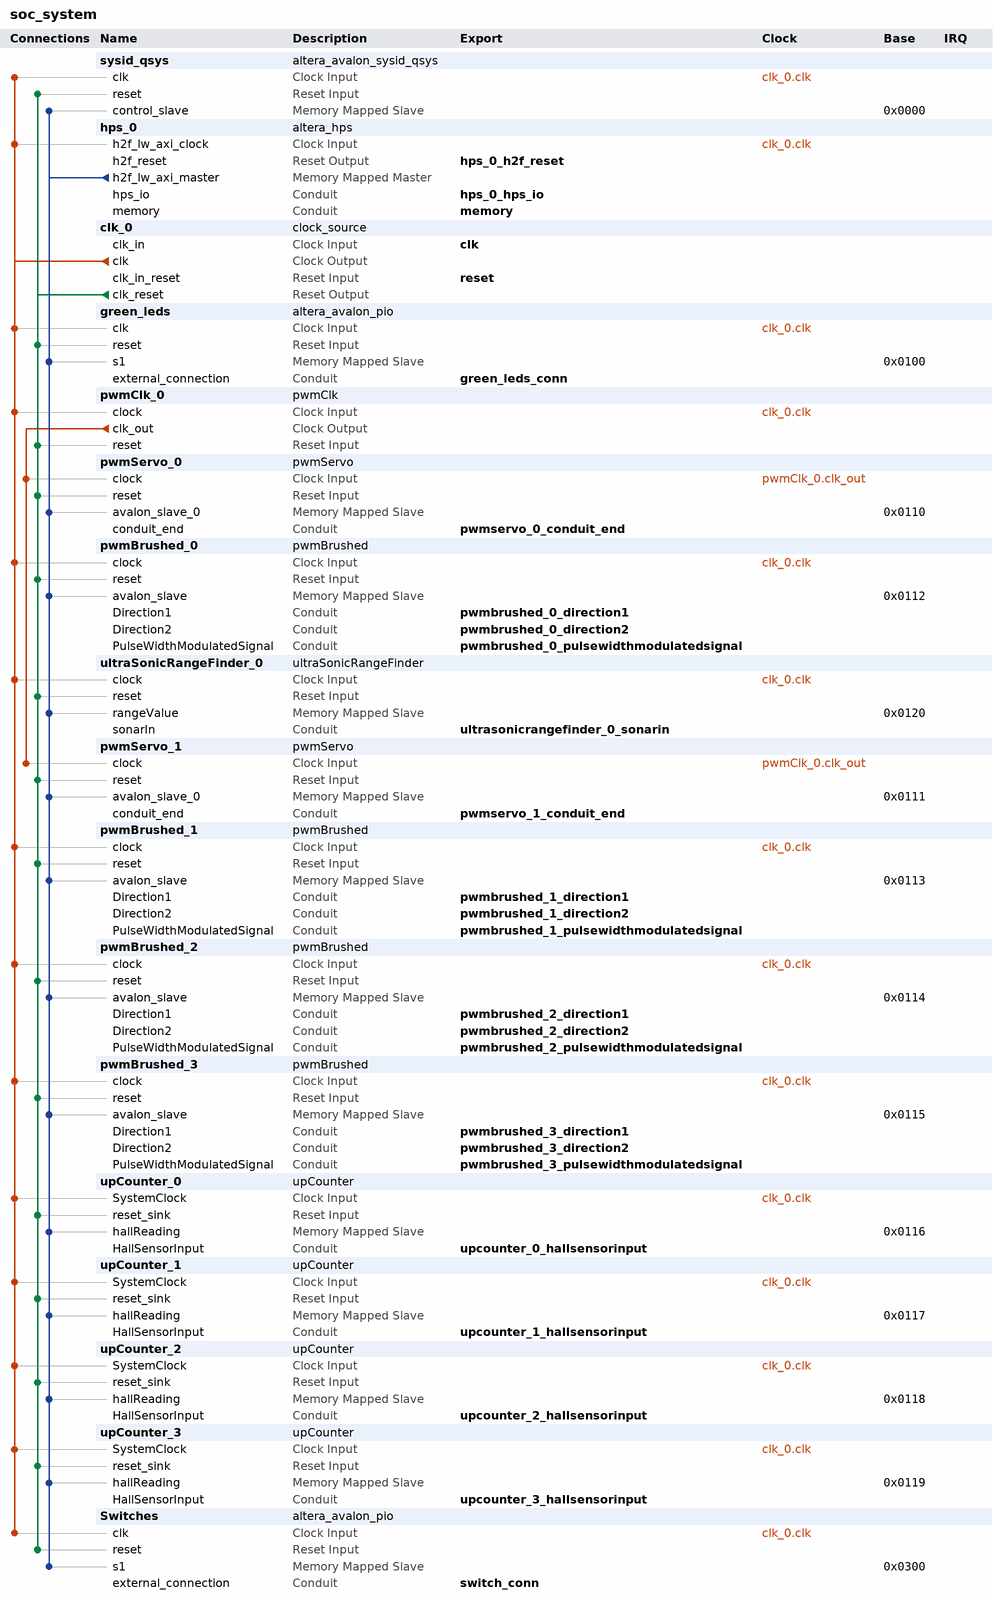
[diagram p0: system contents]
# Platform Designer (Qsys) system soc_system, Cyclone V 5CSEBA6U23I7
# Parameters at their usual value, and those the tool derives, are not listed.
package require -exact qsys 17.0
create_system soc_system
set_project_property DEVICE_FAMILY {Cyclone V}
set_project_property DEVICE 5CSEBA6U23I7

add_instance sysid_qsys altera_avalon_sysid_qsys 17.0
set_instance_parameter_value sysid_qsys id -1395322110

add_instance hps_0 altera_hps 17.0
set_instance_parameter_value hps_0 EMAC1_Mode RGMII
set_instance_parameter_value hps_0 EMAC1_PinMuxing {HPS I/O Set 0}
set_instance_parameter_value hps_0 F2SCLK_COLDRST_Enable false
set_instance_parameter_value hps_0 F2SCLK_DBGRST_Enable false
set_instance_parameter_value hps_0 F2SCLK_WARMRST_Enable false
set_instance_parameter_value hps_0 F2SINTERRUPT_Enable true
set_instance_parameter_value hps_0 F2S_Width 0
set_instance_parameter_value hps_0 FPGA_PERIPHERAL_OUTPUT_CLOCK_FREQ_EMAC0_GTX_CLK 100
set_instance_parameter_value hps_0 FPGA_PERIPHERAL_OUTPUT_CLOCK_FREQ_EMAC0_MD_CLK 100.0
set_instance_parameter_value hps_0 FPGA_PERIPHERAL_OUTPUT_CLOCK_FREQ_EMAC1_GTX_CLK 100
set_instance_parameter_value hps_0 FPGA_PERIPHERAL_OUTPUT_CLOCK_FREQ_EMAC1_MD_CLK 100.0
set_instance_parameter_value hps_0 HPS_PROTOCOL DDR3
set_instance_parameter_value hps_0 I2C0_Mode I2C
set_instance_parameter_value hps_0 I2C0_PinMuxing {HPS I/O Set 0}
set_instance_parameter_value hps_0 I2C1_Mode I2C
set_instance_parameter_value hps_0 I2C1_PinMuxing {HPS I/O Set 0}
set_instance_parameter_value hps_0 LWH2F_Enable true
set_instance_parameter_value hps_0 MEM_BANKADDR_WIDTH 3
set_instance_parameter_value hps_0 MEM_CLK_FREQ 400.0
set_instance_parameter_value hps_0 MEM_COL_ADDR_WIDTH 10
set_instance_parameter_value hps_0 MEM_DQ_WIDTH 32
set_instance_parameter_value hps_0 MEM_DRV_STR RZQ/7
set_instance_parameter_value hps_0 MEM_ROW_ADDR_WIDTH 15
set_instance_parameter_value hps_0 MEM_RTT_NOM RZQ/4
set_instance_parameter_value hps_0 MEM_RTT_WR {Dynamic ODT off}
set_instance_parameter_value hps_0 MEM_TCL 7
set_instance_parameter_value hps_0 MEM_TFAW_NS 30.0
set_instance_parameter_value hps_0 MEM_TRAS_NS 35.0
set_instance_parameter_value hps_0 MEM_TRCD_NS 13.75
set_instance_parameter_value hps_0 MEM_TRFC_NS 260.0
set_instance_parameter_value hps_0 MEM_TRP_NS 13.75
set_instance_parameter_value hps_0 MEM_VENDOR Other
set_instance_parameter_value hps_0 MEM_WTCL 7
set_instance_parameter_value hps_0 QSPI_Mode N/A
set_instance_parameter_value hps_0 QSPI_PinMuxing Unused
set_instance_parameter_value hps_0 REF_CLK_FREQ 25.0
set_instance_parameter_value hps_0 S2FCLK_USER2CLK 4
set_instance_parameter_value hps_0 S2F_Width 0
set_instance_parameter_value hps_0 SDIO_Mode {4-bit Data}
set_instance_parameter_value hps_0 SDIO_PinMuxing {HPS I/O Set 0}
set_instance_parameter_value hps_0 SPIM1_Mode {Single Slave Select}
set_instance_parameter_value hps_0 SPIM1_PinMuxing {HPS I/O Set 0}
set_instance_parameter_value hps_0 STM_Enable false
set_instance_parameter_value hps_0 TIMING_BOARD_AC_SKEW 0.02
set_instance_parameter_value hps_0 TIMING_BOARD_AC_TO_CK_SKEW 0.01
set_instance_parameter_value hps_0 TIMING_BOARD_DQ_TO_DQS_SKEW 0.05
set_instance_parameter_value hps_0 TIMING_BOARD_MAX_CK_DELAY 0.03
set_instance_parameter_value hps_0 TIMING_BOARD_MAX_DQS_DELAY 0.02
set_instance_parameter_value hps_0 TIMING_BOARD_SKEW_BETWEEN_DQS 0.06
set_instance_parameter_value hps_0 TIMING_BOARD_SKEW_CKDQS_DIMM_MAX 0.12
set_instance_parameter_value hps_0 TIMING_BOARD_SKEW_CKDQS_DIMM_MIN 0.06
set_instance_parameter_value hps_0 TIMING_BOARD_SKEW_WITHIN_DQS 0.01
set_instance_parameter_value hps_0 TIMING_TDH 65
set_instance_parameter_value hps_0 TIMING_TDQSCK 255
set_instance_parameter_value hps_0 TIMING_TDQSQ 125
set_instance_parameter_value hps_0 TIMING_TDS 30
set_instance_parameter_value hps_0 TIMING_TIH 140
set_instance_parameter_value hps_0 TIMING_TIS 180
set_instance_parameter_value hps_0 TIMING_TQSH 0.4
set_instance_parameter_value hps_0 UART0_Mode {No Flow Control}
set_instance_parameter_value hps_0 UART0_PinMuxing {HPS I/O Set 0}
set_instance_parameter_value hps_0 USB1_Mode SDR
set_instance_parameter_value hps_0 USB1_PinMuxing {HPS I/O Set 0}
set_instance_parameter_value hps_0 desired_cfg_clk_mhz 100.0
set_instance_parameter_value hps_0 desired_qspi_clk_mhz 370.0
set_instance_parameter_value hps_0 use_default_mpu_clk false

add_instance clk_0 clock_source 17.0
set_instance_parameter_value clk_0 clockFrequency 50000000

add_instance green_leds altera_avalon_pio 17.0
set_instance_parameter_value green_leds direction Output
set_instance_parameter_value green_leds width 8

add_instance pwmClk_0 pwmClk 1.0

add_instance pwmServo_0 pwmServo 1.0

add_instance pwmBrushed_0 pwmBrushed 1.1
set_instance_parameter_value pwmBrushed_0 bits_resolution 8
set_instance_parameter_value pwmBrushed_0 pwm_freq 50000
set_instance_parameter_value pwmBrushed_0 sys_clk 50000000

add_instance ultraSonicRangeFinder_0 ultraSonicRangeFinder 1.0
set_instance_parameter_value ultraSonicRangeFinder_0 cycle_time 49
set_instance_parameter_value ultraSonicRangeFinder_0 sys_clk 50000000
set_instance_parameter_value ultraSonicRangeFinder_0 time_per_inch 147

add_instance pwmServo_1 pwmServo 1.0

add_instance pwmBrushed_1 pwmBrushed 1.1
set_instance_parameter_value pwmBrushed_1 bits_resolution 8
set_instance_parameter_value pwmBrushed_1 pwm_freq 50000
set_instance_parameter_value pwmBrushed_1 sys_clk 50000000

add_instance pwmBrushed_2 pwmBrushed 1.1
set_instance_parameter_value pwmBrushed_2 bits_resolution 8
set_instance_parameter_value pwmBrushed_2 pwm_freq 50000
set_instance_parameter_value pwmBrushed_2 sys_clk 50000000

add_instance pwmBrushed_3 pwmBrushed 1.1
set_instance_parameter_value pwmBrushed_3 bits_resolution 8
set_instance_parameter_value pwmBrushed_3 pwm_freq 50000
set_instance_parameter_value pwmBrushed_3 sys_clk 50000000

add_instance upCounter_0 upCounter 1.0

add_instance upCounter_1 upCounter 1.0

add_instance upCounter_2 upCounter 1.0

add_instance upCounter_3 upCounter 1.0

add_instance Switches altera_avalon_pio 17.0
set_instance_parameter_value Switches direction Input
set_instance_parameter_value Switches width 4

# connections
add_connection clk_0.clk green_leds.clk clock
add_connection clk_0.clk hps_0.h2f_lw_axi_clock clock
add_connection clk_0.clk pwmBrushed_0.clock clock
add_connection clk_0.clk pwmBrushed_1.clock clock
add_connection clk_0.clk pwmBrushed_2.clock clock
add_connection clk_0.clk pwmBrushed_3.clock clock
add_connection clk_0.clk pwmClk_0.clock clock
add_connection clk_0.clk Switches.clk clock
add_connection clk_0.clk sysid_qsys.clk clock
add_connection clk_0.clk ultraSonicRangeFinder_0.clock clock
add_connection clk_0.clk upCounter_0.SystemClock clock
add_connection clk_0.clk upCounter_1.SystemClock clock
add_connection clk_0.clk upCounter_2.SystemClock clock
add_connection clk_0.clk upCounter_3.SystemClock clock
add_connection pwmClk_0.clk_out pwmServo_0.clock clock
add_connection pwmClk_0.clk_out pwmServo_1.clock clock
add_connection clk_0.clk_reset green_leds.reset reset
add_connection clk_0.clk_reset pwmBrushed_0.reset reset
add_connection clk_0.clk_reset pwmBrushed_1.reset reset
add_connection clk_0.clk_reset pwmBrushed_2.reset reset
add_connection clk_0.clk_reset pwmBrushed_3.reset reset
add_connection clk_0.clk_reset pwmClk_0.reset reset
add_connection clk_0.clk_reset pwmServo_0.reset reset
add_connection clk_0.clk_reset pwmServo_1.reset reset
add_connection clk_0.clk_reset Switches.reset reset
add_connection clk_0.clk_reset sysid_qsys.reset reset
add_connection clk_0.clk_reset ultraSonicRangeFinder_0.reset reset
add_connection clk_0.clk_reset upCounter_0.reset_sink reset
add_connection clk_0.clk_reset upCounter_1.reset_sink reset
add_connection clk_0.clk_reset upCounter_2.reset_sink reset
add_connection clk_0.clk_reset upCounter_3.reset_sink reset
add_connection hps_0.h2f_lw_axi_master green_leds.s1 avalon
set_connection_parameter_value hps_0.h2f_lw_axi_master/green_leds.s1 baseAddress 0x0100
add_connection hps_0.h2f_lw_axi_master pwmBrushed_0.avalon_slave avalon
set_connection_parameter_value hps_0.h2f_lw_axi_master/pwmBrushed_0.avalon_slave baseAddress 0x0112
add_connection hps_0.h2f_lw_axi_master pwmBrushed_1.avalon_slave avalon
set_connection_parameter_value hps_0.h2f_lw_axi_master/pwmBrushed_1.avalon_slave baseAddress 0x0113
add_connection hps_0.h2f_lw_axi_master pwmBrushed_2.avalon_slave avalon
set_connection_parameter_value hps_0.h2f_lw_axi_master/pwmBrushed_2.avalon_slave baseAddress 0x0114
add_connection hps_0.h2f_lw_axi_master pwmBrushed_3.avalon_slave avalon
set_connection_parameter_value hps_0.h2f_lw_axi_master/pwmBrushed_3.avalon_slave baseAddress 0x0115
add_connection hps_0.h2f_lw_axi_master pwmServo_0.avalon_slave_0 avalon
set_connection_parameter_value hps_0.h2f_lw_axi_master/pwmServo_0.avalon_slave_0 baseAddress 0x0110
add_connection hps_0.h2f_lw_axi_master pwmServo_1.avalon_slave_0 avalon
set_connection_parameter_value hps_0.h2f_lw_axi_master/pwmServo_1.avalon_slave_0 baseAddress 0x0111
add_connection hps_0.h2f_lw_axi_master Switches.s1 avalon
set_connection_parameter_value hps_0.h2f_lw_axi_master/Switches.s1 baseAddress 0x0300
add_connection hps_0.h2f_lw_axi_master sysid_qsys.control_slave avalon
set_connection_parameter_value hps_0.h2f_lw_axi_master/sysid_qsys.control_slave baseAddress 0x0000
add_connection hps_0.h2f_lw_axi_master ultraSonicRangeFinder_0.rangeValue avalon
set_connection_parameter_value hps_0.h2f_lw_axi_master/ultraSonicRangeFinder_0.rangeValue baseAddress 0x0120
add_connection hps_0.h2f_lw_axi_master upCounter_0.hallReading avalon
set_connection_parameter_value hps_0.h2f_lw_axi_master/upCounter_0.hallReading baseAddress 0x0116
add_connection hps_0.h2f_lw_axi_master upCounter_1.hallReading avalon
set_connection_parameter_value hps_0.h2f_lw_axi_master/upCounter_1.hallReading baseAddress 0x0117
add_connection hps_0.h2f_lw_axi_master upCounter_2.hallReading avalon
set_connection_parameter_value hps_0.h2f_lw_axi_master/upCounter_2.hallReading baseAddress 0x0118
add_connection hps_0.h2f_lw_axi_master upCounter_3.hallReading avalon
set_connection_parameter_value hps_0.h2f_lw_axi_master/upCounter_3.hallReading baseAddress 0x0119

# exported interfaces
add_interface clk clock sink
set_interface_property clk EXPORT_OF clk_0.clk_in
add_interface green_leds_conn conduit end
set_interface_property green_leds_conn EXPORT_OF green_leds.external_connection
add_interface hps_0_h2f_reset reset source
set_interface_property hps_0_h2f_reset EXPORT_OF hps_0.h2f_reset
add_interface hps_0_hps_io conduit end
set_interface_property hps_0_hps_io EXPORT_OF hps_0.hps_io
add_interface memory conduit end
set_interface_property memory EXPORT_OF hps_0.memory
add_interface pwmbrushed_0_direction1 conduit end
set_interface_property pwmbrushed_0_direction1 EXPORT_OF pwmBrushed_0.Direction1
add_interface pwmbrushed_0_direction2 conduit end
set_interface_property pwmbrushed_0_direction2 EXPORT_OF pwmBrushed_0.Direction2
add_interface pwmbrushed_0_pulsewidthmodulatedsignal conduit end
set_interface_property pwmbrushed_0_pulsewidthmodulatedsignal EXPORT_OF pwmBrushed_0.PulseWidthModulatedSignal
add_interface pwmbrushed_1_direction1 conduit end
set_interface_property pwmbrushed_1_direction1 EXPORT_OF pwmBrushed_1.Direction1
add_interface pwmbrushed_1_direction2 conduit end
set_interface_property pwmbrushed_1_direction2 EXPORT_OF pwmBrushed_1.Direction2
add_interface pwmbrushed_1_pulsewidthmodulatedsignal conduit end
set_interface_property pwmbrushed_1_pulsewidthmodulatedsignal EXPORT_OF pwmBrushed_1.PulseWidthModulatedSignal
add_interface pwmbrushed_2_direction1 conduit end
set_interface_property pwmbrushed_2_direction1 EXPORT_OF pwmBrushed_2.Direction1
add_interface pwmbrushed_2_direction2 conduit end
set_interface_property pwmbrushed_2_direction2 EXPORT_OF pwmBrushed_2.Direction2
add_interface pwmbrushed_2_pulsewidthmodulatedsignal conduit end
set_interface_property pwmbrushed_2_pulsewidthmodulatedsignal EXPORT_OF pwmBrushed_2.PulseWidthModulatedSignal
add_interface pwmbrushed_3_direction1 conduit end
set_interface_property pwmbrushed_3_direction1 EXPORT_OF pwmBrushed_3.Direction1
add_interface pwmbrushed_3_direction2 conduit end
set_interface_property pwmbrushed_3_direction2 EXPORT_OF pwmBrushed_3.Direction2
add_interface pwmbrushed_3_pulsewidthmodulatedsignal conduit end
set_interface_property pwmbrushed_3_pulsewidthmodulatedsignal EXPORT_OF pwmBrushed_3.PulseWidthModulatedSignal
add_interface pwmservo_0_conduit_end conduit end
set_interface_property pwmservo_0_conduit_end EXPORT_OF pwmServo_0.conduit_end
add_interface pwmservo_1_conduit_end conduit end
set_interface_property pwmservo_1_conduit_end EXPORT_OF pwmServo_1.conduit_end
add_interface reset reset sink
set_interface_property reset EXPORT_OF clk_0.clk_in_reset
add_interface switch_conn conduit end
set_interface_property switch_conn EXPORT_OF Switches.external_connection
add_interface ultrasonicrangefinder_0_sonarin conduit end
set_interface_property ultrasonicrangefinder_0_sonarin EXPORT_OF ultraSonicRangeFinder_0.sonarIn
add_interface upcounter_0_hallsensorinput conduit end
set_interface_property upcounter_0_hallsensorinput EXPORT_OF upCounter_0.HallSensorInput
add_interface upcounter_1_hallsensorinput conduit end
set_interface_property upcounter_1_hallsensorinput EXPORT_OF upCounter_1.HallSensorInput
add_interface upcounter_2_hallsensorinput conduit end
set_interface_property upcounter_2_hallsensorinput EXPORT_OF upCounter_2.HallSensorInput
add_interface upcounter_3_hallsensorinput conduit end
set_interface_property upcounter_3_hallsensorinput EXPORT_OF upCounter_3.HallSensorInput

set_interconnect_requirement {$system} qsys_mm.clockCrossingAdapter HANDSHAKE
set_interconnect_requirement {$system} qsys_mm.maxAdditionalLatency 1

save_system soc_system.qsys
